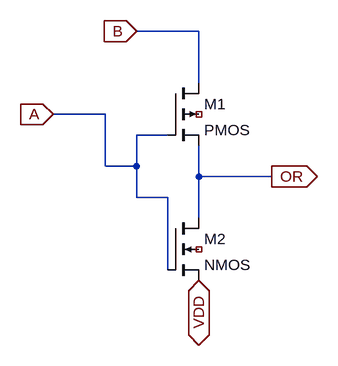
[diagram p0: schematic OR_GDI_VDD.asc]
OR_GDI_VDD.asc, the LTspice schematic file:
Version 4
SHEET 1 880 680
WIRE 208 -32 112 -32
WIRE 208 48 208 -32
WIRE 64 96 -16 96
WIRE 160 128 112 128
WIRE 64 176 64 96
WIRE 112 176 112 128
WIRE 112 176 64 176
WIRE 208 192 208 144
WIRE 320 192 208 192
WIRE 112 224 112 176
WIRE 160 224 112 224
WIRE 208 256 208 192
WIRE 160 336 160 224
FLAG -16 96 A
IOPIN -16 96 In
FLAG 112 -32 B
IOPIN 112 -32 In
FLAG 320 192 OR
IOPIN 320 192 Out
FLAG 208 352 VDD
IOPIN 208 352 BiDir
SYMBOL pmos4 160 48 R0
SYMATTR InstName M1
SYMBOL nmos4 160 256 R0
SYMATTR InstName M2

The netlist it stands for:
* OR_GDI_VDD.asc
M1 B A OR NC_01 PMOS
M2 OR A VDD NC_02 NMOS
.model NMOS NMOS
.model PMOS PMOS
.lib standard.mos
.backanno
.end